# Altium schematic sheet SerialConnector.SchDoc
size A4; SheetNumber: 12; SheetTotal: 13
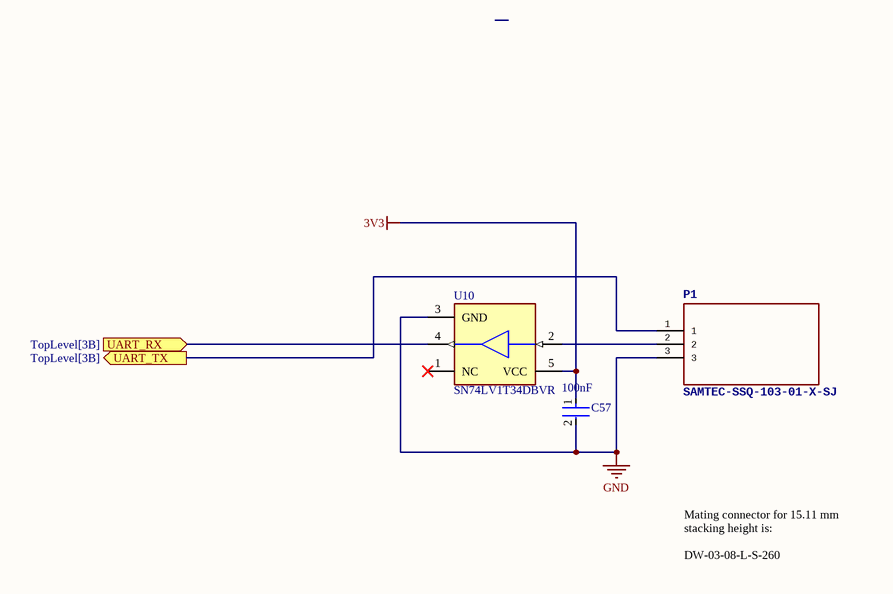
[diagram p0: SerialConnector.SchDoc]

## Parts
C57  Capacitance: 100nF  [FP-GRM155-0_05-IPC_C]  (hidden comment: GRM155R71E104KE14J)
P1  SAMTEC-SSQ-103-01-X-SJ  [SAMTEC-SSQ-103-01-X-S]
U10  SN74LV1T34DBVR  [FP-DBV0005A-IPC_B]

## Ports
UART_RX (in, see TopLevel[3B]), UART_TX (out, see TopLevel[3B])

## Nets
3V3: C57.1 U10.5(VCC)
GND: C57.2 P1.3 U10.3(GND)
UART_RX: U10.4(Y) ; port UART_RX
UART_TX: P1.1 ; port UART_TX
NetP1_2: P1.2 U10.2(A)

Not connected (* = marked no-connect by the designer): U10 1(NC)*

## Notes on the sheet
- Mating connector for 15.11 mm stacking height is:
  DW-03-08-L-S-260

## Library data of the parts
C57 = CMP-06035-003995-1: Chip Multilayer Ceramic Capacitors for General Purpose, 0402, 0.10uF, X7R, 15%, 10%, 25V; Resistor Type: Ceramic; Tolerance: 10%; Case Code (Metric): 1005; Termination: SMD/SMT; Mount: Surface Mount; Voltage Rating: 25V; Voltage Rating (DC): 25V; Case Code (Imperial): 0402; Max Operating Temperature: 125°C; Weight: 0.000212oz; Case/Package: 0402; Length: 0.039inch; Width: 0.5mm; Thickness: 0.022inch; Height: 0.5mm; Packaging: Tape and Reel; Package Quantity: 50000; Min Operating Temperature: -55°C; Dielectric: X7R
U10 = CMP-0859-00123-4: IC BUF NON-INVERT 5.5V SOT23-5; Low Level Output Current: 8mA; Polarity: Non-Inverting; Number of Channels: 1; Propagation Delay: 15.5ns; High Level Output Current: -8mA; Quiescent Current: 1uA; Logic Function: Buffer; Min Supply Voltage: 1.6V; Min Operating Temperature: -40°C; Package Quantity: 3000; Max Operating Temperature: 125°C; Operating Supply Current: 8mA; Radiation Hardening: No; REACH SVHC: No SVHC; Number of Bits per Element: 1; Mount: Surface Mount; Number of Outputs: 1; Lead Free: Lead Free; Number of Pins: 5; Weight: 0.000353oz; Number of Output Lines: 1; Number of Elements: 1; Number of Input Lines: 1; Number of Bits: 1; Case/Package: SOT-23-5; Packaging: Tape and Reel; Max Supply Voltage: 5.5V; Number of Inputs: 1